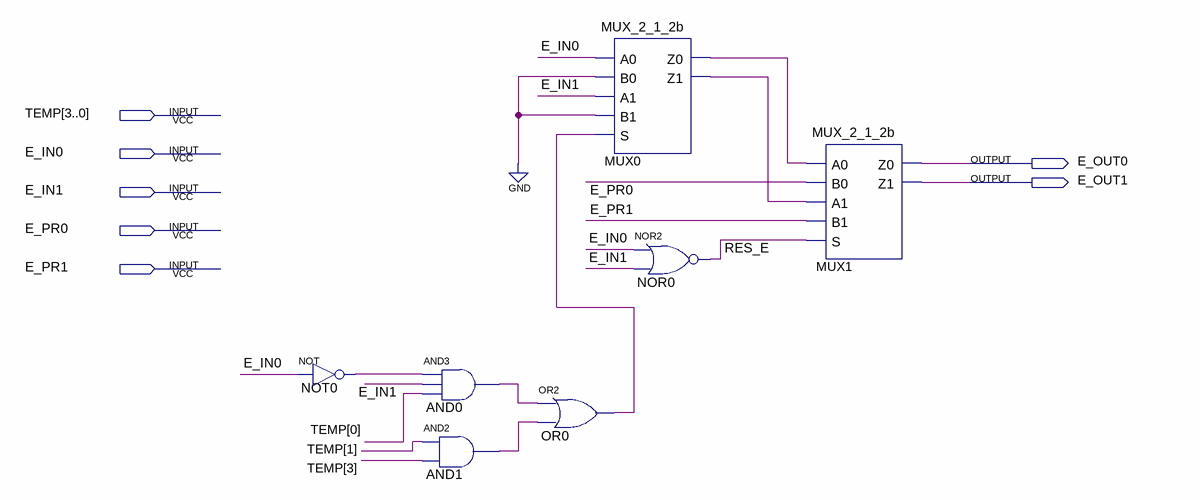
[diagram p0: schematic sheet]
// Quartus schematic LOG_ESTADO.bdf as structural Verilog: 7 symbols, 7 pins
module LOG_ESTADO (
  input  [3:0] TEMP,
  input  E_IN0,
  input  E_IN1,
  input  E_PR0,
  input  E_PR1,
  output E_OUT0,
  output E_OUT1
);

  wire AND0_out, AND1_out, MUX0_z0, MUX0_z1, NOT0_out, OR0_out, RES_E;

  not NOT0 (NOT0_out, E_IN0);
  and AND0 (AND0_out, NOT0_out, E_IN1, TEMP[0]);
  and AND1 (AND1_out, TEMP[1], TEMP[3]);
  MUX_2_1_2b MUX0 (.A0(E_IN0), .B0(1'b0), .A1(E_IN1), .B1(1'b0), .S(OR0_out), .Z0(MUX0_z0), .Z1(MUX0_z1));
  or OR0 (OR0_out, AND0_out, AND1_out);
  nor NOR0 (RES_E, E_IN0, E_IN1);
  MUX_2_1_2b MUX1 (.A0(MUX0_z0), .B0(E_PR0), .A1(MUX0_z1), .B1(E_PR1), .S(RES_E), .Z0(E_OUT0), .Z1(E_OUT1));
endmodule
